# EasyEDA Pro project Power_Board_2026-08-07.eprj

# Schematic Schematic1

## Sheets
1 P1: Board Name: Board1; Create Date: 2026-08-07
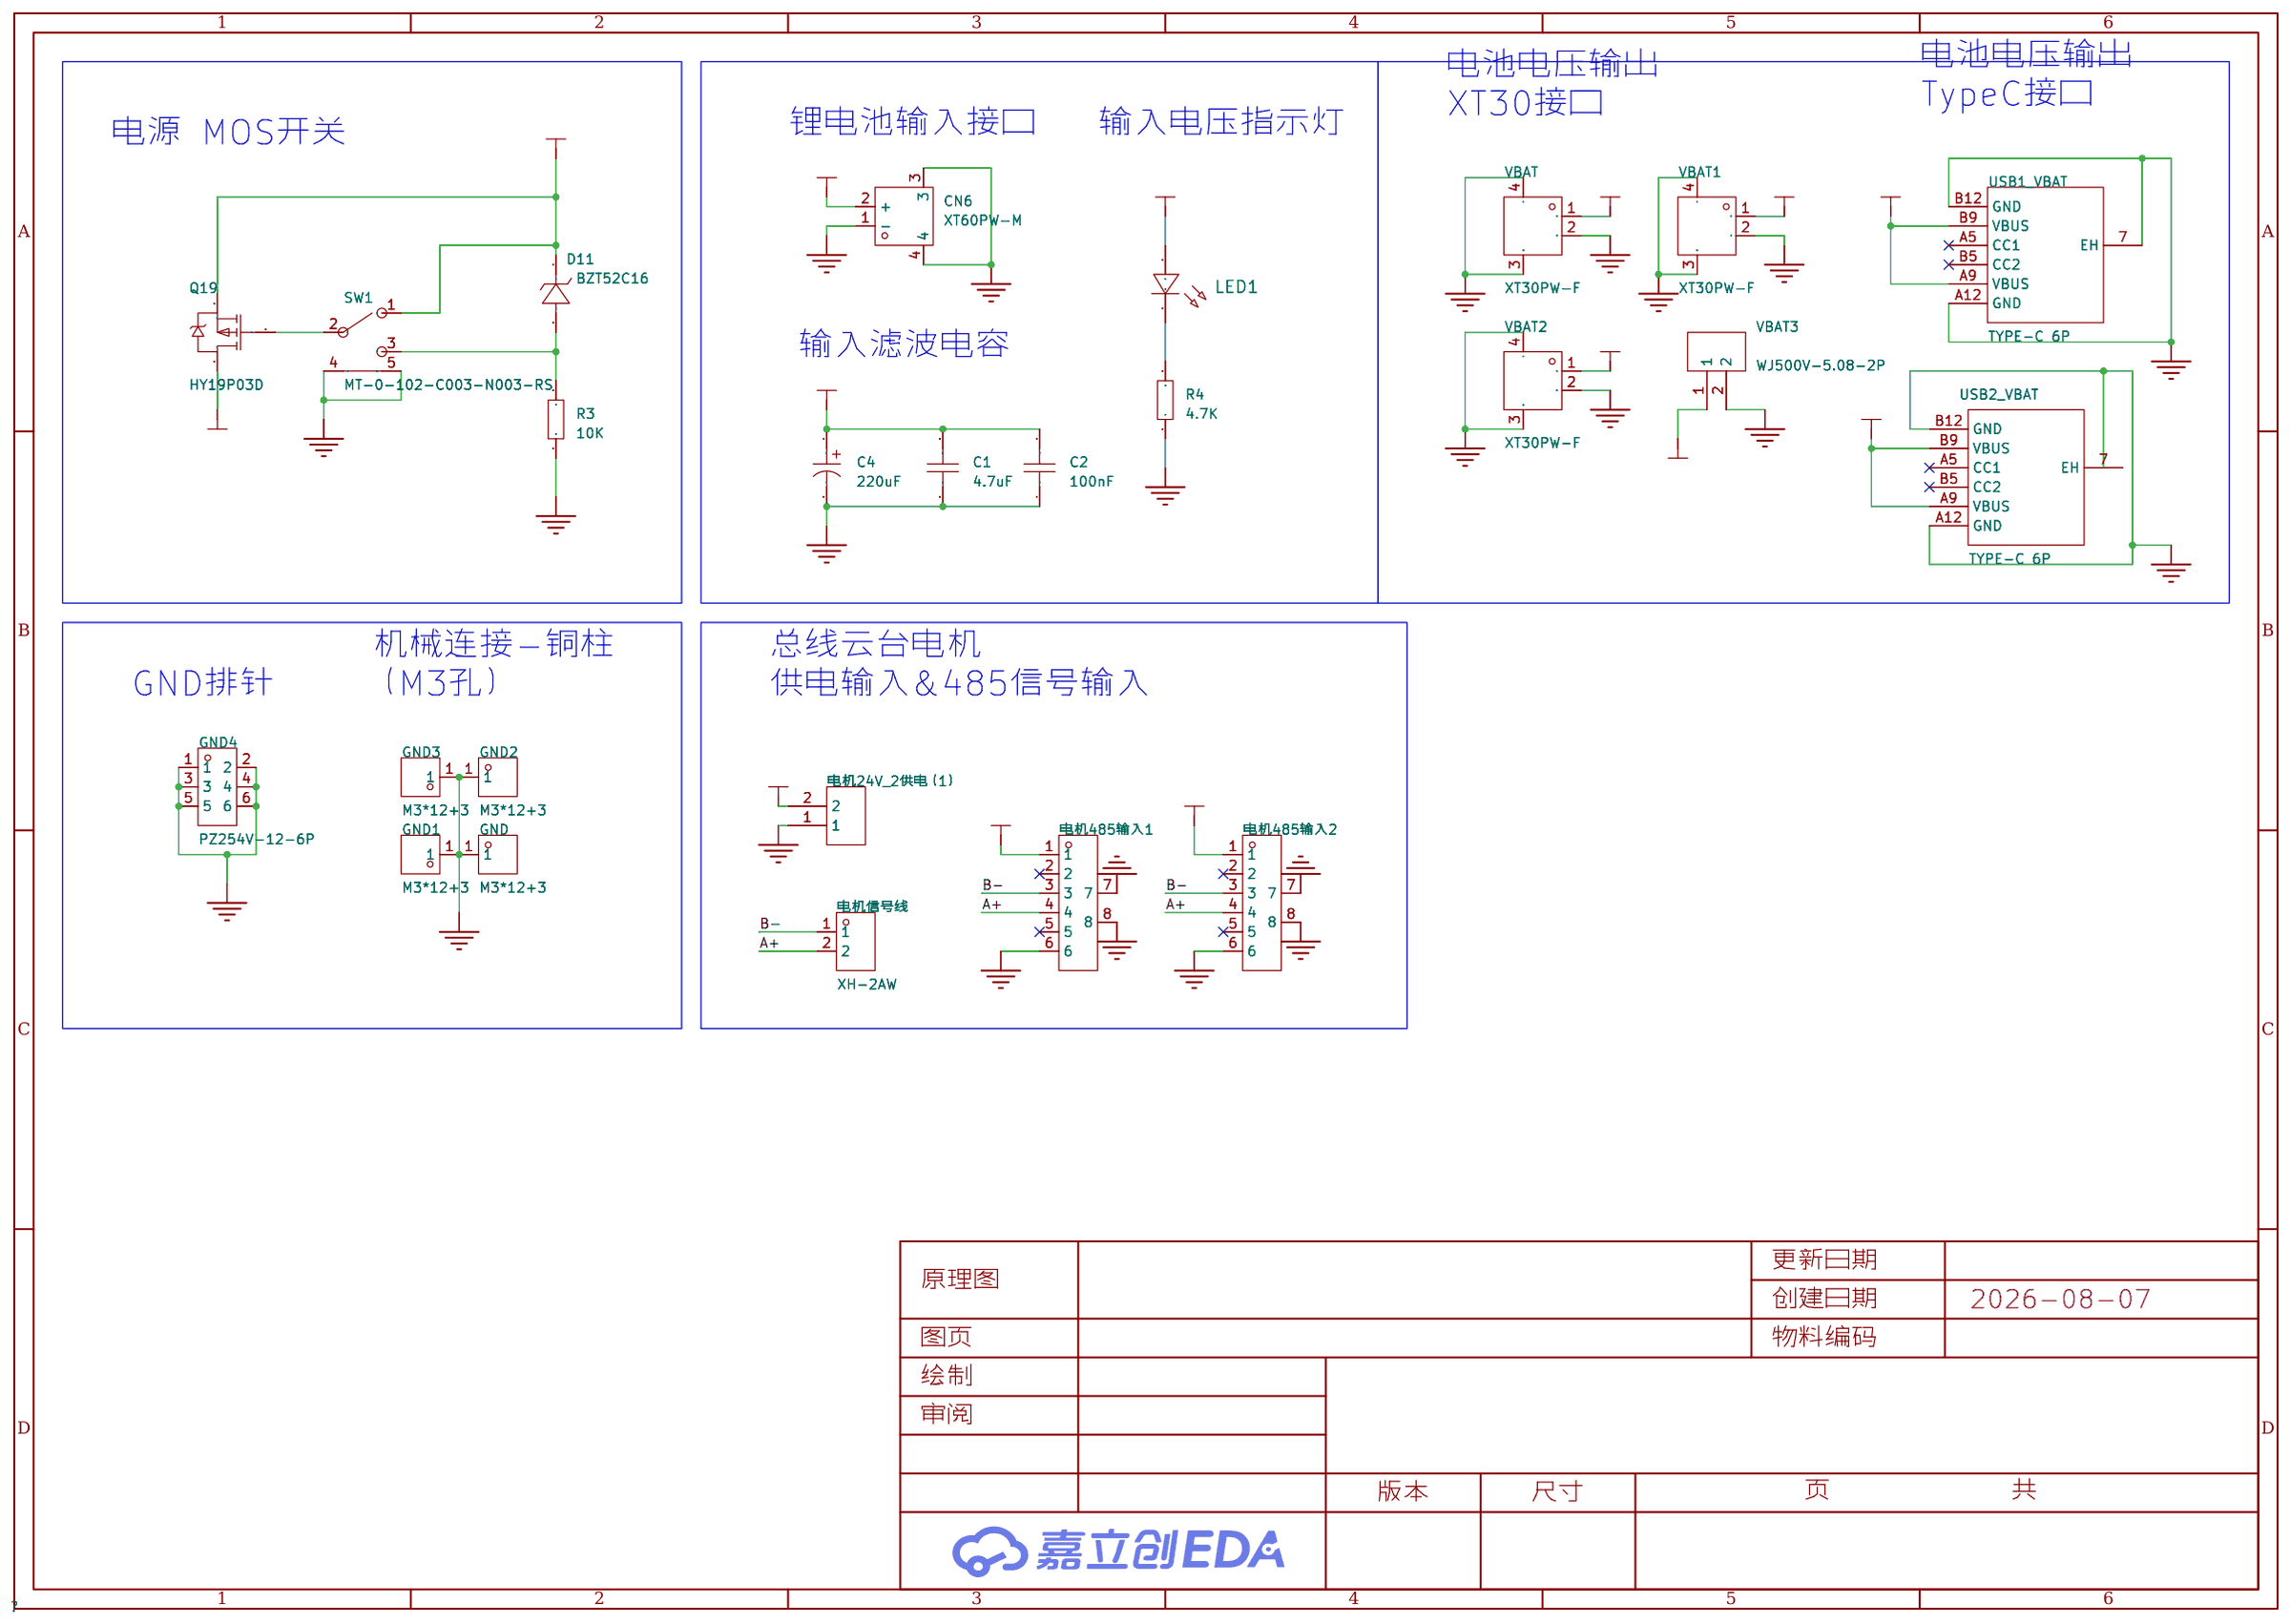
[diagram p0: P1]
2 P2: Create Date: 2026-08-10
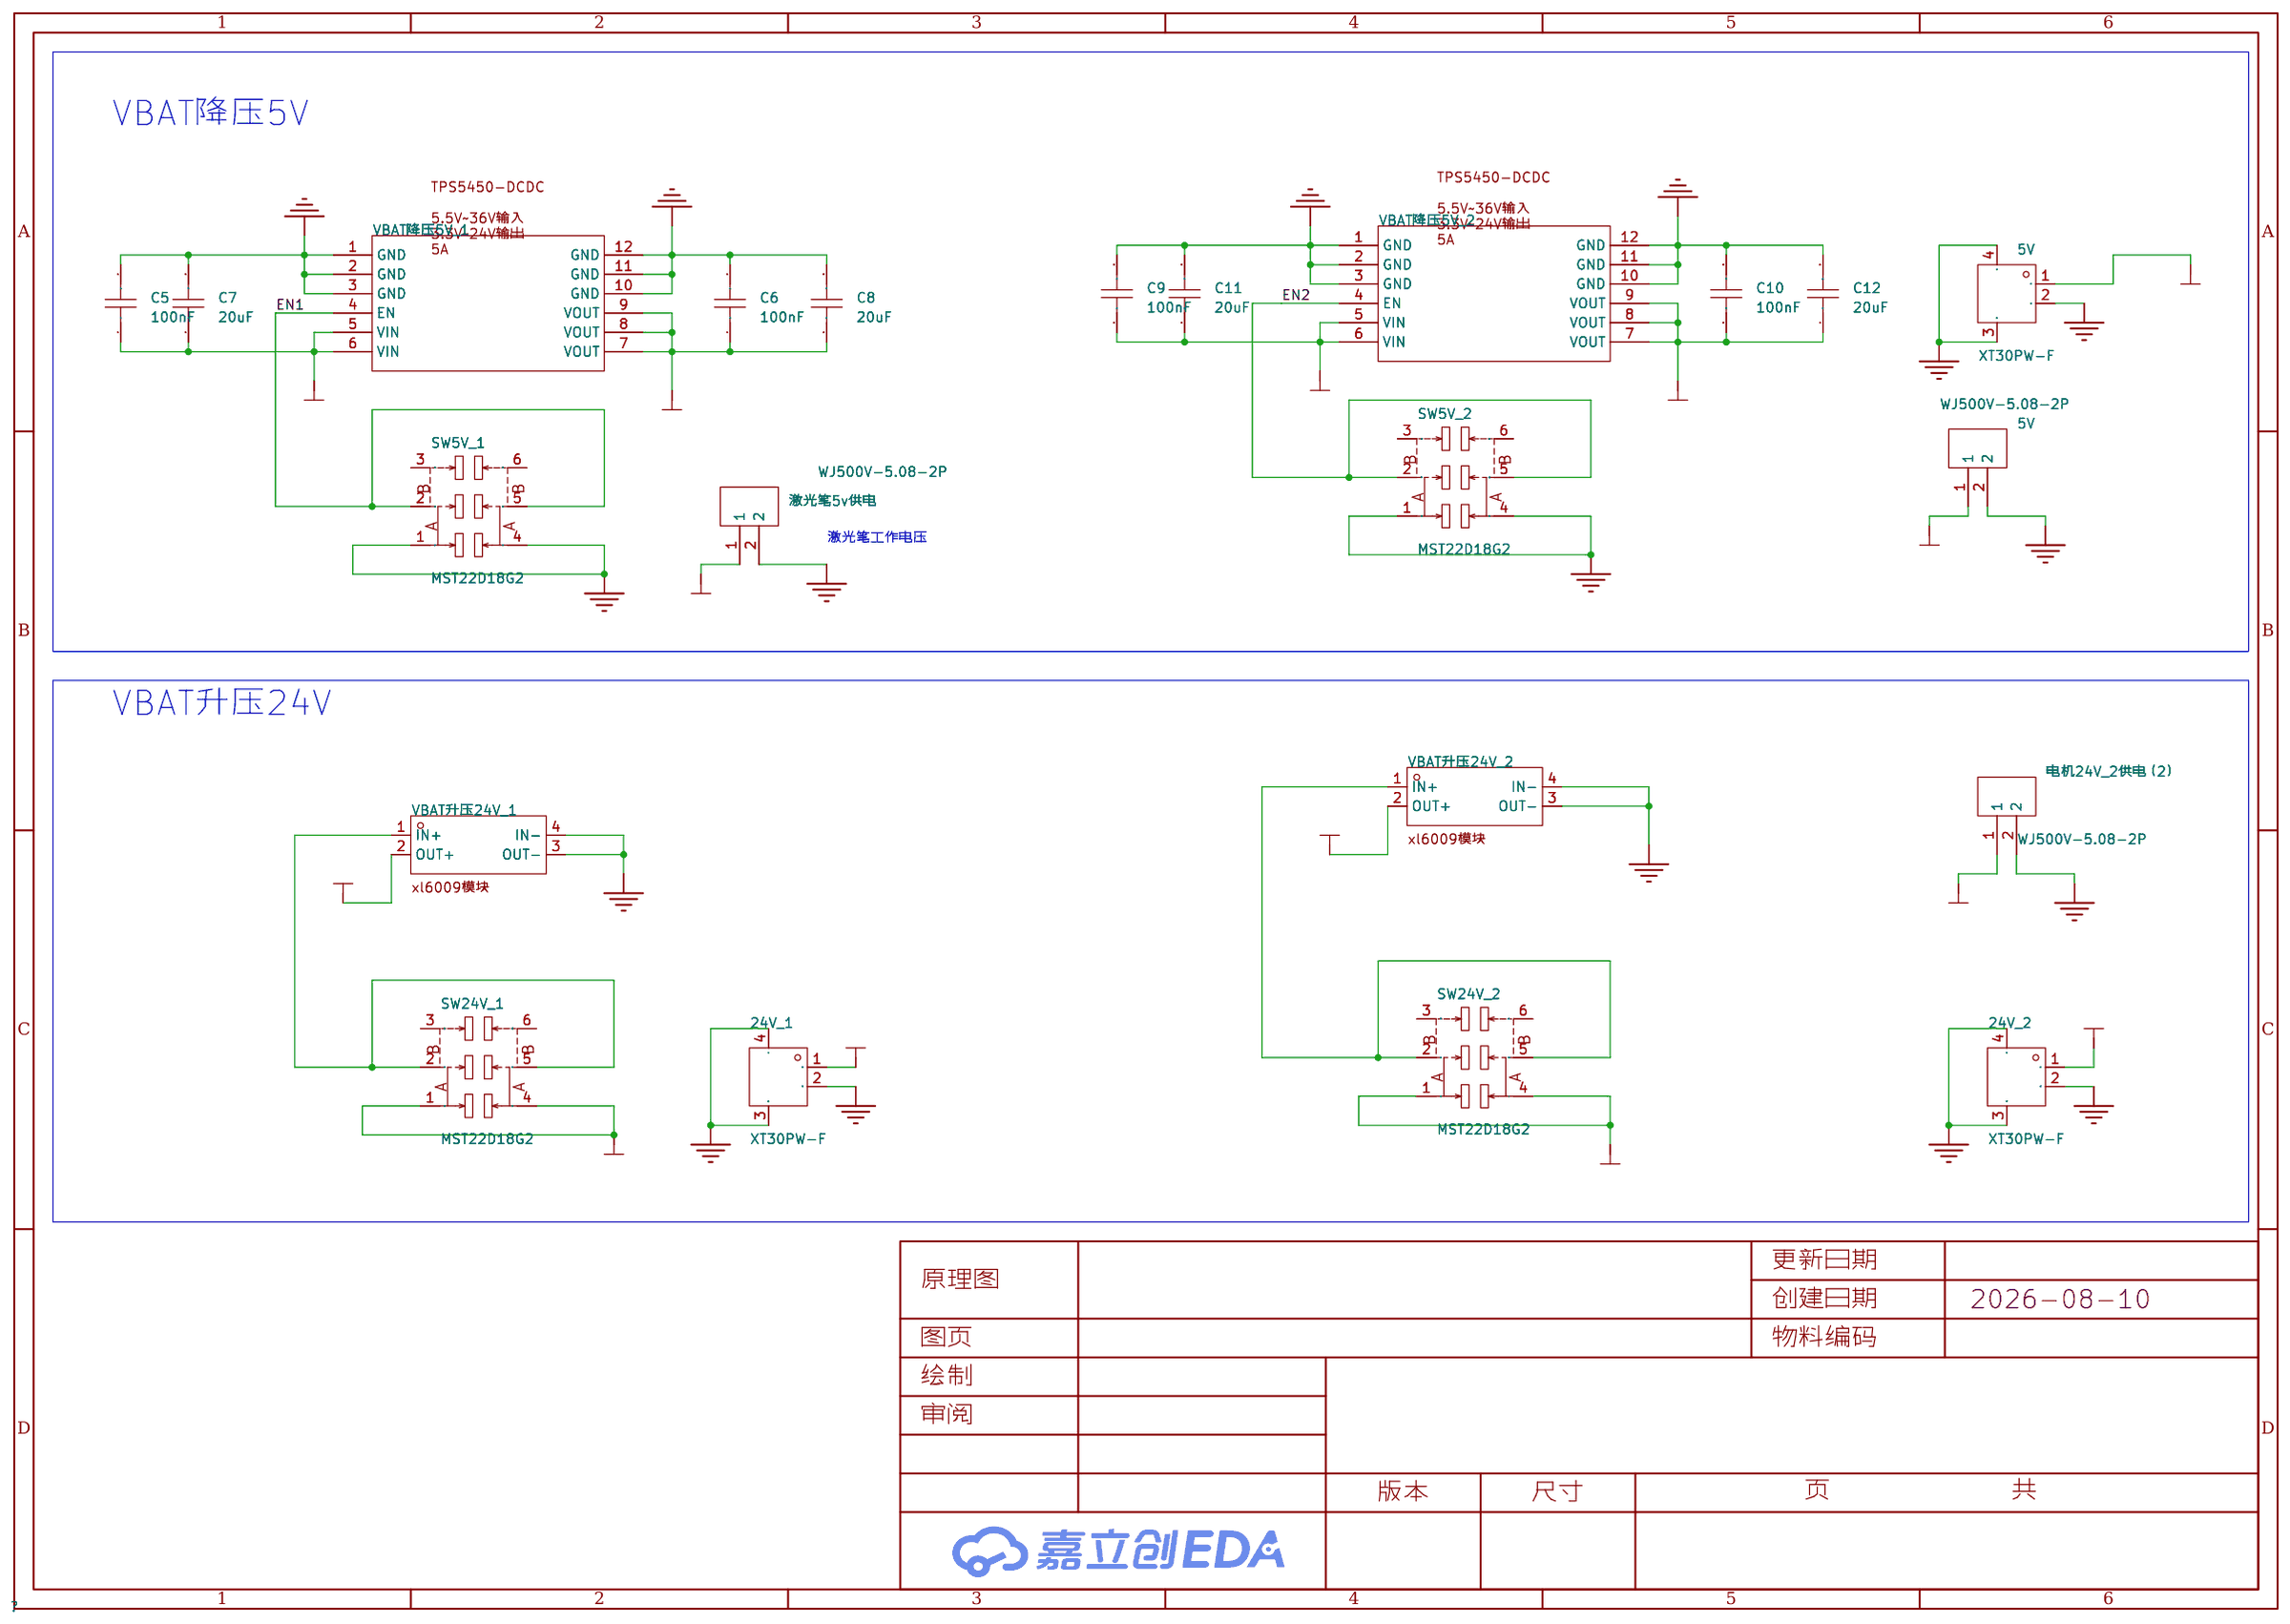
[diagram p1: P2]

## Parts
sheet P1
C1  4.7uF  [C1210]
C2  100nF  [C0603]
C4  220uF  [CAP-TH_BD8.0-P3.50-D0.6-FD-2]
CN6  XT60PW-M  [CONN-TH_XT60PW-M]
D11  BZT52C16  [SOD-123_L2.7-W1.7-LS3.8-RD]
GND  M3*12+3  [TH_BD4.7-D3.0]
GND1  M3*12+3  [TH_BD4.7-D3.0]
GND2  M3*12+3  [TH_BD4.7-D3.0]
GND3  M3*12+3  [TH_BD4.7-D3.0]
GND4  PZ254V-12-6P  [HDR-TH_6P-P2.54-V-M-R2-C3-S2.54]
LED1  -  [LED_0805]
Q19  HY19P03D  [TO-252-2_L6.6-W6.1-P4.57-LS9.9-TL-CW]
R3  10K  [R0603]
R4  4.7K  [R0603]
SW1  MT-0-102-C003-N003-RS  [SW-TH_MT-0-102-C003-N003-RS]
USB1_VBAT  TYPE-C 6P  [TYPE-C-SMD_TYPE-C-6P_1]
USB2_VBAT  TYPE-C 6P  [TYPE-C-SMD_TYPE-C-6P_1]
VBAT  XT30PW-F  [CONN-TH_XT30PW-F-1]
VBAT1  XT30PW-F  [CONN-TH_XT30PW-F-1]
VBAT2  XT30PW-F  [CONN-TH_XT30PW-F-1]
VBAT3  WJ500V-5.08-2P  [CONN-TH_2P-P5.00_WJ500V-5.08-2P]
电机24V_2供电（1）  WJ500V-5.08-2P  [CONN-TH_2P-P5.00_WJ500V-5.08-2P]
电机485输入1  HDGC1501WR-S-6P  [CONN-SMD_6P-P1.50_HDGC1501WR-S-6P]
电机485输入2  HDGC1501WR-S-6P  [CONN-SMD_6P-P1.50_HDGC1501WR-S-6P]
电机信号线  XH-2AW  [CONN-TH_XH-2AW_C2908611]
sheet P2
5V  XT30PW-F  [CONN-TH_XT30PW-F-1]
5V#2  WJ500V-5.08-2P  [CONN-TH_2P-P5.00_WJ500V-5.08-2P]
24V_1  XT30PW-F  [CONN-TH_XT30PW-F-1]
24V_2  XT30PW-F  [CONN-TH_XT30PW-F-1]
C5  100nF  [C0603]
C6  100nF  [C0603]
C7  20uF  [C2220]
C8  20uF  [C2220]
C9  100nF  [C0603]
C10  100nF  [C0603]
C11  20uF  [C2220]
C12  20uF  [C2220]
SW5V_1  MST22D18G2  [SW-SMD_MST22D18G2]
SW5V_2  MST22D18G2  [SW-SMD_MST22D18G2]
SW24V_1  MST22D18G2  [SW-SMD_MST22D18G2]
SW24V_2  MST22D18G2  [SW-SMD_MST22D18G2]
VBAT升压24V_1  -  [XL6009]
VBAT升压24V_2  -  [XL6009]
VBAT降压5V_1  -  [TPS5450降压模块]
VBAT降压5V_2  -  [TPS5450降压模块]
激光笔5v供电  WJ500V-5.08-2P  [CONN-TH_2P-P5.00_WJ500V-5.08-2P]
电机24V_2供电（2）  WJ500V-5.08-2P  [CONN-TH_2P-P5.00_WJ500V-5.08-2P]

## Library data of the parts
C1 = GRM32ER71H475KA88L: 容值:4.7uF;精度:±10%;额定电压:50V;材质(温度系数):X7R;; LCSC Part Name: 4.7uF ±10% 50V; Supplier Part: C86052; Manufacturer: muRata(村田); Supplier Footprint: 1210; JLCPCB Part Class: 扩展库; Datasheet: https://atta.szlcsc.com/upload/public/pdf/source/20200305/C490387_23319AE8C154DEB24C505E6C82A8106A.pdf; Supplier: LCSC; Tolerance: ±10%; Voltage Rated: 50V; Temperature Coefficient: X7R
C2 = CC0603KRX7R9BB104: 容值:100nF;精度:±10%;额定电压:50V;材质(温度系数):X7R;; LCSC Part Name: 100nF ±10% 50V; Supplier Part: C14663; Manufacturer: YAGEO(国巨); Supplier Footprint: 0603; JLCPCB Part Class: 基础库; Datasheet: https://atta.szlcsc.com/upload/public/pdf/source/20180910/C282072_33301C7F631E79921B82A8DAC6BCC5B3.pdf; Supplier: LCSC; Tolerance: ±10%; Voltage Rated: 50V; Temperature Coefficient: X7R
C4 = KNH2220UF35V149EC0049: 容值:220uF;精度:±20%;额定电压:35V;纹波电流:1.7A@100kHz;等效串联电阻:40mΩ@100kHz;; LCSC Part Name: 220uF ±20% 35V; Supplier Part: C2981462; Manufacturer: KNSCHA(科尼盛); Supplier Footprint: 插件,D8xL9mm; JLCPCB Part Class: 扩展库; Datasheet: https://atta.szlcsc.com/upload/public/pdf/source/20220426/9FC8A158D93B909CC105160B4A0CB698.pdf; Supplier: LCSC; Tolerance: ±20%; Rated Voltage: 35V; Ripple Current: 1.7A@100kHz; Equivalent Series Resistance(ESR): 40mΩ@100kHz; Lead Spacing: 3.5mm; φD: 8mm; L: 9mm; Lifetime @ Temp: 2000hrs@105℃; Operating Temperature: -55℃~+105℃
CN6 = XT60PW-M: 类别:-;类型1:-;; LCSC Part Name: AMASS(艾迈斯)航模插头xt60连接器150公母对接pw锂电池公头 板插卧式XT60PW-M; Supplier Part: C98732; Manufacturer: AMASS(艾迈斯); JLCPCB Part Class: 扩展库; Datasheet: https://atta.szlcsc.com/upload/public/pdf/source/20240118/44A3DCFF53BE25DC65378AFFB21277A4.pdf; Supplier: LCSC; Brand: 艾迈斯; Type: 卧式插头; Colour: 黄色; InterfaceType: 公头
D11 = BZT52C16_C727007: 二极管配置:独立式;稳压值(标称值):16V;稳压值(范围):15.3V~17.1V;功率:500mW;精度:-;; Supplier Part: C727007; Manufacturer: TWGMC(台湾迪嘉); Supplier Footprint: SOD-123; JLCPCB Part Class: 扩展库; Datasheet: https://atta.szlcsc.com/upload/public/pdf/source/20200828/C727006_A23CB424A23C0F54CFF10A724B844049.pdf; Supplier: LCSC; Diode Configuration: 独立式; Zener Voltage (Nom): 16V; Reverse Leakage Current (Ir): 100nA@11.2V; Zener Voltage (Range): 15.3V~17.1V; Power Dissipation: 500mW; Zener Impedance (Zzt): 40Ω
GND GND1-GND3 = M3*12+3: 铜柱M3*12+3; LCSC Part Name: 国产 铜柱M3*12+3 不环保 M3*12+3; Supplier Part: C110574; Manufacturer: 国产; JLCPCB Part Class: Extended Part; Supplier: LCSC
GND4 = PZ254V-12-6P: 插针结构:2x3P;间距:2.54mm;行距:2.54mm;圆针/方针:方针;安装类型:直插;排数:双排;总PIN位数:6P;额定电流:-;额定电压:-;配合针长度:6mm;塑高:2.5mm;端接针长度:3mm;触头材质:黄铜;触头镀层:-;工作温度范围:-40℃~+105℃;颜色:黑色;; LCSC Part Name: 间距:2.54mm 2x3P 直插 方针; Supplier Part: C492420; Manufacturer: XFCN(兴飞); Supplier Footprint: 插件,P=2.54mm; JLCPCB Part Class: 扩展库; Datasheet: https://atta.szlcsc.com/upload/public/pdf/source/20200309/C492420_BAECB307B001054C09D200388220EAE6.pdf; Supplier: LCSC; Pin Structure: 2x3P; Pitch: 2.54mm; Row Spacing: 2.54mm; Circluar Pins/Square Pins: 方针; Mounting Type: 直插; Number of Rows: 双排; Number of Pins: 6P; Length of Mating Pin: 6mm; Insulation Height: 2.5mm; Length of End Connection Pin: 3mm; Contact Material: 黄铜; Operating Temperature Range: -40℃~+105℃; Color: 黑色
LED1 = LED_0805-R: Supplier Footprint: 0805
Q19 = HY19P03D: 类型:P沟道;漏源电压(Vdss):30V;连续漏极电流(Id):90A;功率(Pd):50W;导通电阻(RDS(on)@Vgs,Id):6mΩ@10V,45A;阈值电压(Vgs(th)@Id):3V@250uA;; LCSC Part Name: P沟道 30V 90A; Supplier Part: C122492; Manufacturer: HUAYI(华羿微); Supplier Footprint: TO-252-2; JLCPCB Part Class: 扩展库; Datasheet: https://atta.szlcsc.com/upload/public/pdf/source/20170728/C122492_1501225751911848809.pdf; Supplier: LCSC; Type: P沟道; Drain Source Voltage (Vdss): 30V; Continuous Drain Current (Id): 90A; Power Dissipation (Pd): 50W; Drain Source On Resistance (RDS(on)@Vgs,Id): 6mΩ@10V,45A; Gate Threshold Voltage (Vgs(th)@Id): 3V@250uA
R3 R4 = Res_0603: Supplier Footprint: 0603
SW1 = MT-0-102-C003-N003-RS: 电路结构:单刀双掷;机械寿命:-;额定电流:5A;额定电压(AC):125V;安装方式:弯插;; LCSC Part Name: 小型钮子三脚二档(正弯脚); Supplier Part: C1788495; Manufacturer: YUEN FUNG(源丰); Supplier Footprint: 插件; JLCPCB Part Class: 扩展库; Datasheet: https://atta.szlcsc.com/upload/public/pdf/source/20201225/C1788495_6ED2FCF2206E4816011DDFBA986C5590.pdf; Supplier: LCSC; Circuit: 单刀双掷; Switch Length: 13.1mm; Switch Width: 8mm; Contact Current: 5A; Voltage Rating (AC): 125V; Actuator Type: 圆柱钮柄; Pin Style: PC引脚; Mounting Style: 弯插; Operating Temperature: -25℃~+85℃
USB1_VBAT USB2_VBAT = TYPE-C 6P: LCSC Part Name: 6P卧贴母座; Supplier Part: C456012; Manufacturer: SHOU HAN(首韩); Supplier Footprint: SMD; JLCPCB Part Class: 扩展库; Datasheet: https://item.szlcsc.com/datasheet/TYPE-C%25206P/458819.html; Supplier: LCSC; Connector Type: Type-C; Gender: 母; Mounting Type: 卧贴; Number of Contacts: 6P; Number of Ports: 1; Current Rating-Power: 3A; Voltage Rating: 5V; Connect-Disconnect Life: 3千次; Detection color: 黑色; Operating Temperature: -40℃~+85℃
5V 24V_1 24V_2 VBAT VBAT1 VBAT2 = XT30PW-F: 类别:-;类型1:-;; LCSC Part Name: AMASS(艾迈斯)电源连接器 母头 XT30PW-F; Supplier Part: C2913282; Manufacturer: AMASS(艾迈斯); JLCPCB Part Class: 扩展库; Datasheet: https://atta.szlcsc.com/upload/public/pdf/source/20231218/06CFCF98887A9A87638B0856A725C8FD.pdf; Supplier: LCSC; Brand: 艾迈斯; Type: 航模插头; InterfaceType: 母头
5V#2 VBAT3 激光笔5v供电 电机24V_2供电（2） = WJ500V-5.08-2P: LCSC Part Name: 1x2P 5.08mm 直插 排数:1 每排P数:2; Supplier Part: C8465; Manufacturer: KANGNEX(康奈克斯电气); Supplier Footprint: 插件,P=5.08mm; JLCPCB Part Class: 扩展库; Datasheet: https://item.szlcsc.com/datasheet/WJ500V-5.08-2P/8959.html; Supplier: LCSC; Number of Positions or Pins: 1x2P; Pitch: 5.08mm; Color: 绿色; Mounting Type: 直插; Number of Pins: 2P; Number of Rows: 1; Number of PINs Per Row: 2; Screw Specification: M2.5; Current Rating: 18A; Voltage Rating (Max): 250V; Wire Gauge - AWG: 14~30; Wire Gauge - mm2: 2.5; Operating Temperature: -40℃~+105℃
电机24V_2供电（1） = WJ500V-5.08-2P: LCSC Part Name: 1x2P 5.08mm 直插 排数:1 每排P数:2; Supplier Part: C8465; Manufacturer: KANGNEX(康奈克斯电气); Supplier Footprint: 插件,P=5.08mm; JLCPCB Part Class: 扩展库; Datasheet: https://item.szlcsc.com/datasheet/WJ500V-5.08-2P/8959.html; Supplier: LCSC; Number of Positions or Pins: 1x2P; Pitch: 5.08mm; Color: 绿色; Mounting Type: 直插; Number of Pins: 2P; Number of Rows: 1; Number of PINs Per Row: 2; Screw Specification: M2.5; Current Rating: 18A; Voltage Rating (Max): 250V; Wire Gauge - AWG: 14~30; Wire Gauge - mm2: 2.5; Operating Temperature: -40℃~+105℃; Structure: 1x2P; Mounting Style: 直插; Current Rating (Max): 18A; Operating Temperature Range: -40℃~+105℃
电机485输入1 电机485输入2 = HDGC1501WR-S-6P: 插针结构:1x6P;间距:1.5mm;安装方式:卧贴;参考系列:ZH;总PIN数:6P;排数:1;每排PIN数:6;行距:-;额定电流:1A;工作温度范围:-25℃~+70℃;; LCSC Part Name: 1x6P 间距:1.5mm 卧贴 系列:ZH; Supplier Part: C2936220; Manufacturer: HDGC(华德共创); Supplier Footprint: SMD,P=1.5mm,卧贴; JLCPCB Part Class: Extended Part; Datasheet: https://atta.szlcsc.com/upload/public/pdf/source/20211224/A5C6461CBF12DC2884B3F43D30F9D45A.pdf; Supplier: LCSC; Pins Structure: 1x6P; Pitch: 1.5mm; Mounting Style: 卧贴; Reference Series: ZH; Number of Pins: 6P; Number of Rows: 1; Number of PINs Per Row: 6; Current Rating (Max): 1A; Operating Temperature Range: -25℃~+70℃
电机信号线 = XH-2AW_C2908611: 插针结构:1x2P;间距:2.5mm;安装方式:弯插;参考系列:XH;总PIN数:2P;排数:1;每排PIN数:2;行距:-;额定电流:3A;触头材质:黄铜;触头镀层:锡;工作温度范围:-25℃~+85℃;; LCSC Part Name: 1x2P 间距:2.5mm 弯插 系列:XH; Supplier Part: C2908611; Manufacturer: HCTL(华灿天禄); Supplier Footprint: 弯插,P=2.5mm; JLCPCB Part Class: 扩展库; Datasheet: https://atta.szlcsc.com/upload/public/pdf/source/20230711/B565BAF3B11666EF6B81B3605408F2BD.pdf; Supplier: LCSC; Pins Structure: 1x2P; Pitch: 2.5mm; Mounting Style: 弯插; Reference Series: XH; Number of Pins: 2P; Number of Rows: 1; Number of PINs Per Row: 2; Current Rating (Max): 3A; Contact Material: 黄铜; Contact Plating: 锡; Operating Temperature Range: -25℃~+85℃
C5 C6 C9 C10 = FCC0603B104K500CT: LCSC Part Name: 100nF ±10% 50V; Supplier Part: C5137636; Manufacturer: FOJAN(富捷); Supplier Footprint: 0603; Datasheet: https://item.szlcsc.com/datasheet/FCC0603B104K500CT/5747088.html; Supplier: LCSC; Tolerance: ±10%; Voltage Rating: 50V; Temperature Coefficient: X7R
C7 C8 C11 C12 = C2220X206K5RLCAUTO: LCSC Part Name: 20uF ±10% 50V; Supplier Part: C3842434; Manufacturer: KEMET(基美); Supplier Footprint: 2220; Datasheet: https://atta.szlcsc.com/upload/public/pdf/source/231023/C1812C944KARLC7800-0e709abee088822a599ce4fc1cb526dd.pdf; Supplier: LCSC; Tolerance: ±10%; Voltage Rated: 50V; Temperature Coefficient: X7R
SW5V_1 SW5V_2 SW24V_1 SW24V_2 = MST22D18G2: LCSC Part Name: MST-22D18G2; Supplier Part: C431544; Manufacturer: SHOU HAN(首韩); Supplier Footprint: SMD,9.1x3.6mm; JLCPCB Part Class: 扩展库; Datasheet: https://item.szlcsc.com/datasheet/MST22D18G2/427901.html; Supplier: LCSC; Circuit: 双刀双掷; Termination Style: SMD接片; Length: 9.1mm; Width: 3.6mm; Switch Height: 3.45mm; Mounting Type: 立贴; Current Rating: 50mA; Voltage Rating: 12V; Life: 1万次; Operating Temperature: -30℃~+80℃
VBAT升压24V_1 VBAT升压24V_2 = XL6009
VBAT降压5V_1 VBAT降压5V_2 = TPS5450降压模块

## Nets
+5V_2: 5V.1 5V#2.1 C10.1 C12.1 VBAT降压5V_2.7(VOUT) VBAT降压5V_2.8(VOUT) VBAT降压5V_2.9(VOUT)
+24V_1: 24V_1.1 VBAT升压24V_1.2(OUT+)
+24V_2: 24V_2.1 VBAT升压24V_2.2(OUT+) 电机24V_2供电（1）.2 电机24V_2供电（2）.1 电机485输入1.1 电机485输入2.1
GND: 5V.2 5V.3 5V.4 5V#2.2 24V_1.2 24V_1.3 24V_1.4 24V_2.2 24V_2.3 24V_2.4 C1.1 C2.1 C4.2 C5.2 C6.2 C7.2 C8.2 C9.2 C10.2 C11.2 C12.2 CN6.1(-) CN6.3 CN6.4 GND.1 GND1.1 GND2.1 GND3.1 GND4.1 GND4.2 GND4.3 GND4.4 GND4.5 GND4.6 R3.1 R4.1 SW1.4 SW1.5 SW5V_1.1 SW5V_1.4 SW5V_2.1 SW5V_2.4 USB1_VBAT.7(EH) USB1_VBAT.A12(GND) USB1_VBAT.B12(GND) USB2_VBAT.7(EH) USB2_VBAT.A12(GND) USB2_VBAT.B12(GND) VBAT.2 VBAT.3 VBAT.4 VBAT1.2 VBAT1.3 VBAT1.4 VBAT2.2 VBAT2.3 VBAT2.4 VBAT3.2 VBAT升压24V_1.3(OUT-) VBAT升压24V_1.4(IN-) VBAT升压24V_2.3(OUT-) VBAT升压24V_2.4(IN-) VBAT降压5V_1.1(GND) VBAT降压5V_1.2(GND) VBAT降压5V_1.3(GND) VBAT降压5V_1.10(GND) VBAT降压5V_1.11(GND) VBAT降压5V_1.12(GND) VBAT降压5V_2.1(GND) VBAT降压5V_2.2(GND) VBAT降压5V_2.3(GND) VBAT降压5V_2.10(GND) VBAT降压5V_2.11(GND) VBAT降压5V_2.12(GND) 激光笔5v供电.2 电机24V_2供电（1）.1 电机24V_2供电（2）.2 电机485输入1.6 电机485输入1.7 电机485输入1.8 电机485输入2.6 电机485输入2.7 电机485输入2.8
VBAT: C1.2 C2.2 C4.1 C5.1 C7.1 C9.1 C11.1 LED1.2(A) Q19.2(D) SW24V_1.1 SW24V_1.4 SW24V_2.1 SW24V_2.4 USB1_VBAT.A9(VBUS) USB1_VBAT.B9(VBUS) USB2_VBAT.A9(VBUS) USB2_VBAT.B9(VBUS) VBAT.1 VBAT1.1 VBAT2.1 VBAT3.1 VBAT降压5V_1.5(VIN) VBAT降压5V_1.6(VIN) VBAT降压5V_2.5(VIN) VBAT降压5V_2.6(VIN)
VBUS: CN6.2(+) D11.1(K) Q19.3(S) SW1.1
A+: 电机485输入1.4 电机485输入2.4 电机信号线.2
B-: 电机485输入1.3 电机485输入2.3 电机信号线.1
EN1: SW5V_1.2 SW5V_1.5 VBAT降压5V_1.4(EN)
EN2: SW5V_2.2 SW5V_2.5 VBAT降压5V_2.4(EN)
VOP_5V: C6.1 C8.1 VBAT降压5V_1.7(VOUT) VBAT降压5V_1.8(VOUT) VBAT降压5V_1.9(VOUT) 激光笔5v供电.1
$1N642: Q19.1(G) SW1.2
$1N648: LED1.1(C) R4.2
$1N653: D11.2(A) R3.2 SW1.3
$2N1435: SW24V_2.2 SW24V_2.5 VBAT升压24V_2.1(IN+)
$2N5555: SW24V_1.2 SW24V_1.5 VBAT升压24V_1.1(IN+)

Not connected (* = marked no-connect by the designer): SW5V_1 3 6; SW5V_2 3 6; SW24V_1 3 6; SW24V_2 3 6; USB1_VBAT A5(CC1)* B5(CC2)*; USB2_VBAT A5(CC1)* B5(CC2)*; 电机485输入1 2* 5*; 电机485输入2 2* 5*

## Notes on the sheets
sheet 1
- 电池电压输出
  TypeC接口
- 电池电压输出
  XT30接口
- 电源 MOS开关
- 锂电池输入接口
- 输入电压指示灯
- 输入滤波电容
- GND排针
- 机械连接-铜柱
  （M3孔）
- 总线云台电机
  供电输入&485信号输入
sheet 2
- VBAT降压5V
- 激光笔工作电压
- VBAT升压24V

# Board PCB1
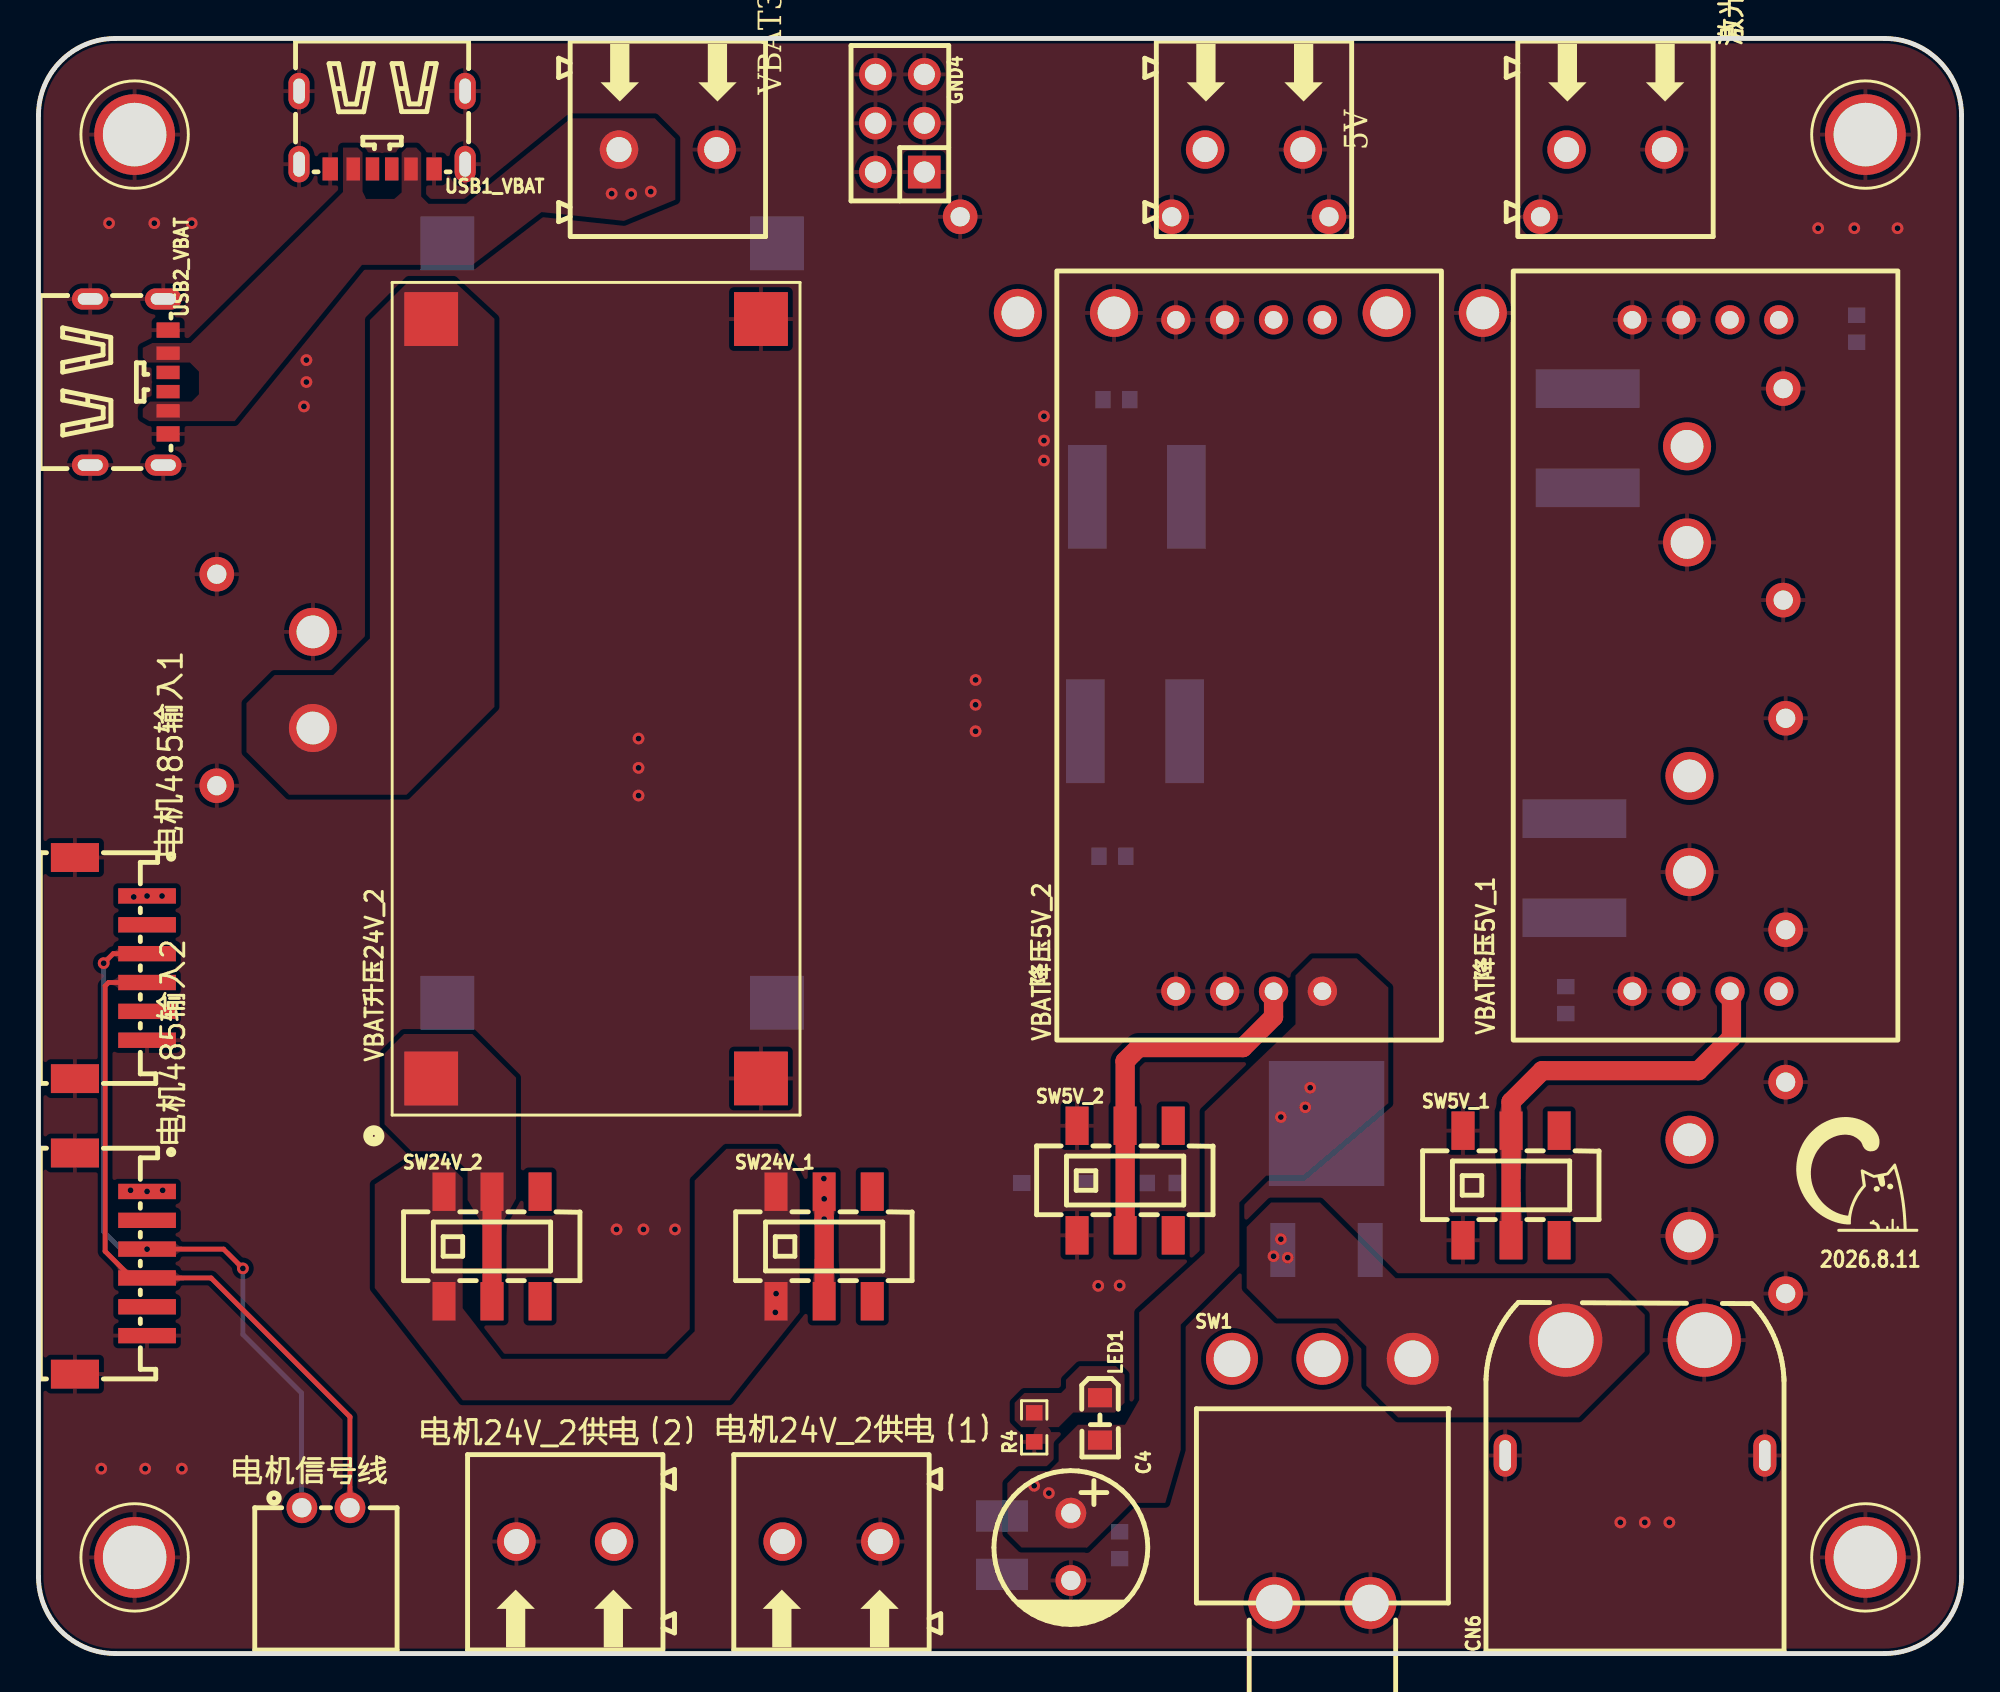
[diagram p2: board, top side]
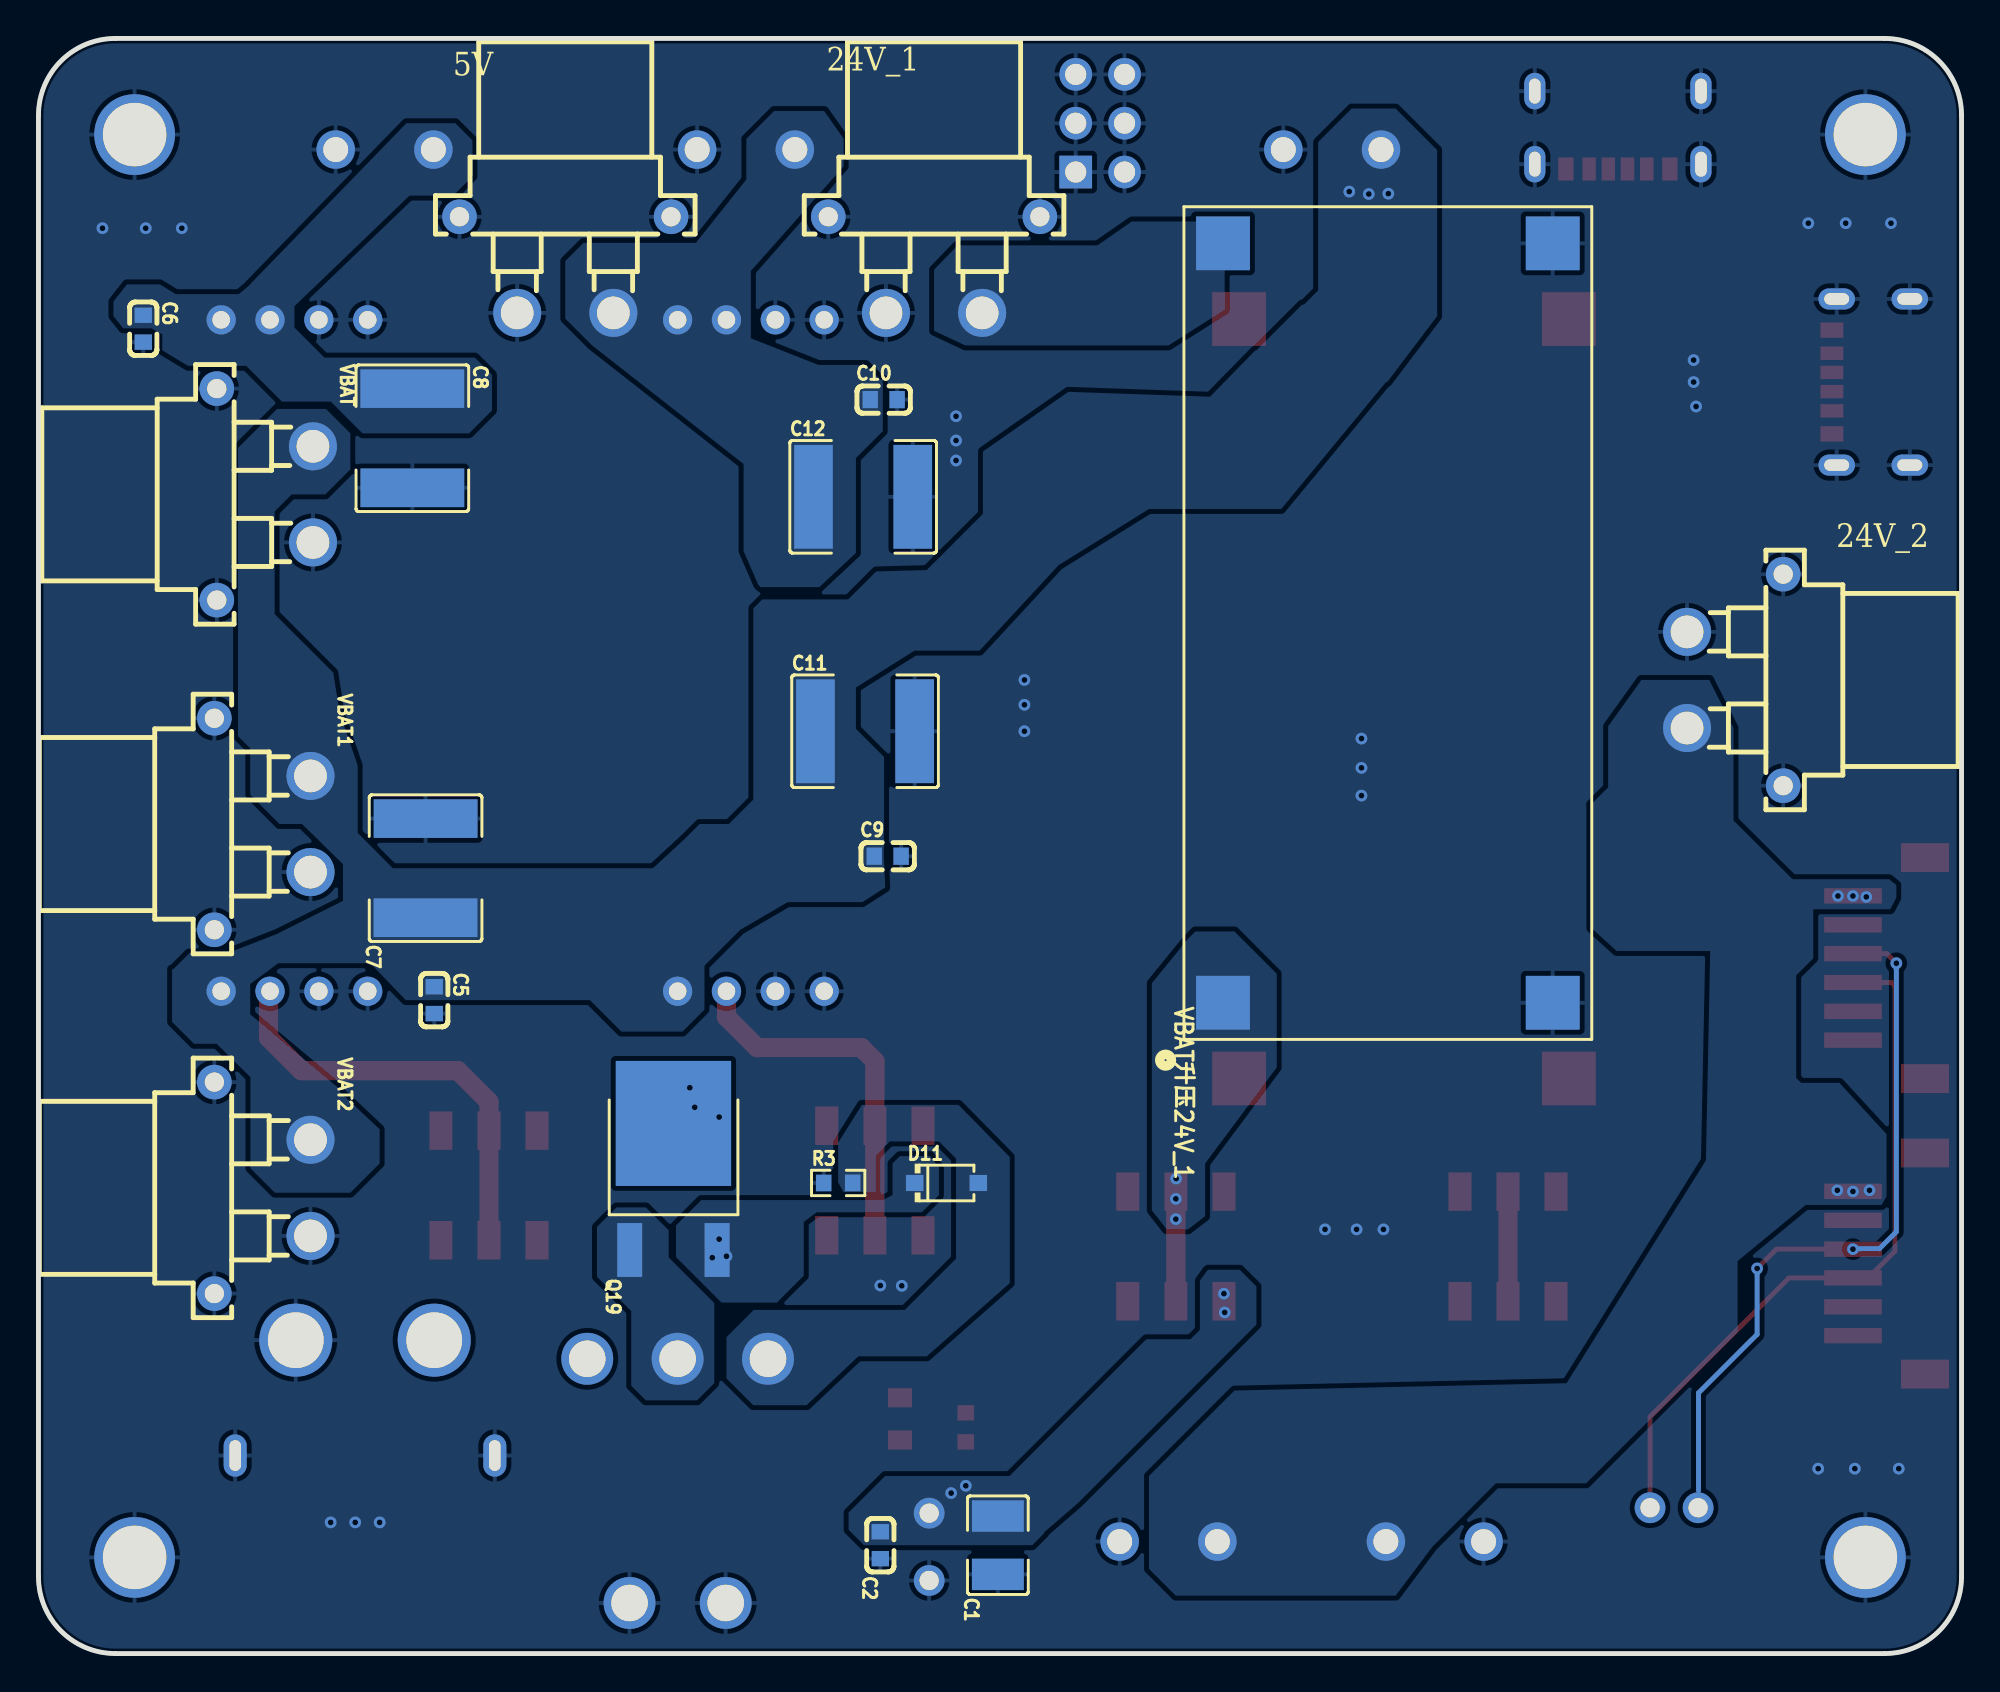
[diagram p3: board, bottom side, seen from below]

Outline 100 x 84 mm; copper layers: Top Layer, Bottom Layer. Coordinates in mm from the lower left corner of the outline.
Outline path: 0,80 0,4 arc(1.17,1.17) 4,0 96,0 arc(98.83,1.17) 100,4 100,80 arc(98.83,82.83) 96,84 4,84 arc(1.17,82.83) 0,80
Stack: Top Layer 0.035mm / Dielectric1 1.51mm FR4 er 4.5 / Bottom Layer 0.035mm

## Design rules (mm)
net B-: DP1
net A+: DP1
template: JLCPCB Capability(Two Layers Board)
spacing copperThickness1oz (default): track to track 0.102, other pairs 0.152 to 0.3
spacing copperThickness2oz: track to track 0.203, other pairs 0.152 to 0.3
track width copperThickness1oz (default): min 0.127, default 0.254, max 2.54
track width copperThickness2oz: min 0.203, default 0.254, max 2.54
differential pair differentialPair (default): width min 0.127, default 0.254, max 2.54; gap min 0.152, default 0.152
via viaSize (default): diameter min 0.5, default 0.61, max 10; hole min 0.3, default 0.305, max 6.3

## Placement (name value [footprint] x y rotation side)
5V  XT30PW-F  [CONN-TH_2P-P5.00_WJ500V-5.08-2P]  63.21 78.22 0 top
5V#2  WJ500V-5.08-2P  [CONN-TH_XT30PW-F-1]  72.61 72.23 0 bottom
24V_1  XT30PW-F  [CONN-TH_XT30PW-F-1]  53.43 72.23 0 bottom
24V_2  XT30PW-F  [CONN-TH_XT30PW-F-1]  11.77 50.64 90 bottom
C1  4.7uF  [C1210]  50.11 5.63 90 bottom
C2  100nF  [C0603]  56.22 5.63 90 bottom
C4  220uF  [CAP-TH_BD8.0-P3.50-D0.6-FD-2]  53.68 5.55 270 top
C5  100nF  [C0603]  79.42 33.98 270 bottom
C6  100nF  [C0603]  94.55 68.9 270 bottom
C7  20uF  [C2220]  79.87 40.85 90 bottom
C8  20uF  [C2220]  80.56 63.21 270 bottom
C9  100nF  [C0603]  55.84 41.47 180 bottom
C10  100nF  [C0603]  56.05 65.22 180 bottom
C11  20uF  [C2220]  57.02 47.97 180 bottom
C12  20uF  [C2220]  57.12 60.16 180 bottom
CN6  XT60PW-M  [CONN-TH_XT60PW-M]  83.02 13.3 90 top
D11  BZT52C16  [SOD-123_L2.7-W1.7-LS3.8-RD]  52.78 24.47 180 bottom
GND  M3*12+3  [TH_BD4.7-D3.0]  95 5 0 top
GND1  M3*12+3  [TH_BD4.7-D3.0]  5 5 0 top
GND2  M3*12+3  [TH_BD4.7-D3.0]  95 79 0 top
GND3  M3*12+3  [TH_BD4.7-D3.0]  5 79 0 top
GND4  PZ254V-12-6P  [HDR-TH_6P-P2.54-V-M-R2-C3-S2.54]  44.79 79.59 90 top
LED1  YLED0805R  [LED_0805]  55.2 12.16 270 top
Q19  HY19P03D  [TO-252-2_L6.6-W6.1-P4.57-LS9.9-TL-CW]  66.98 24.28 90 bottom
R3  10K  [R0603]  58.41 24.47 180 bottom
R4  4.7K  [R0603]  51.78 11.76 90 top
SW1  MT-0-102-C003-N003-RS  [SW-TH_MT-0-102-C003-N003-RS]  66.76 8.98 0 top
SW5V_1  MST22D18G2  [SW-SMD_MST22D18G2]  76.58 24.35 0 top
SW5V_2  MST22D18G2  [SW-SMD_MST22D18G2]  56.5 24.6 0 top
SW24V_1  MST22D18G2  [SW-SMD_MST22D18G2]  40.86 21.17 0 top
SW24V_2  MST22D18G2  [SW-SMD_MST22D18G2]  23.58 21.17 0 top
USB1_VBAT  TYPE-C 6P  [TYPE-C-SMD_TYPE-C-6P_1]  17.87 79.24 180 top
USB2_VBAT  TYPE-C 6P  [TYPE-C-SMD_TYPE-C-6P_1]  4.72 66.13 270 top
VBAT  XT30PW-F  [CONN-TH_XT30PW-F-1]  88.23 60.29 270 bottom
VBAT1  XT30PW-F  [CONN-TH_XT30PW-F-1]  88.35 43.14 270 bottom
VBAT2  XT30PW-F  [CONN-TH_XT30PW-F-1]  88.35 24.22 270 bottom
VBAT3  WJ500V-5.08-2P  [CONN-TH_2P-P5.00_WJ500V-5.08-2P]  32.73 78.22 0 top
VBAT升压24V_1  -  [XL6009]  32.73 51.65 90 bottom
VBAT升压24V_2  -  [XL6009]  26.1 47.72 90 top
VBAT降压5V_1  -  [TPS5450降压模块]  86.69 51.91 90 top
VBAT降压5V_2  -  [TPS5450降压模块]  62.95 51.91 90 top
激光笔5v供电  WJ500V-5.08-2P  [CONN-TH_2P-P5.00_WJ500V-5.08-2P]  82 78.22 0 top
电机24V_2供电（1）  WJ500V-5.08-2P  [CONN-TH_2P-P5.00_WJ500V-5.08-2P]  41.24 5.82 180 top
电机24V_2供电（2）  WJ500V-5.08-2P  [CONN-TH_2P-P5.00_WJ500V-5.08-2P]  27.39 5.82 180 top
电机485输入1  HDGC1501WR-S-6P  [CONN-SMD_6P-P1.50_HDGC1501WR-S-6P]  3.77 35.65 270 top
电机485输入2  HDGC1501WR-S-6P  [CONN-SMD_6P-P1.50_HDGC1501WR-S-6P]  3.77 20.28 270 top
电机信号线  XH-2AW  [CONN-TH_XH-2AW_C2908611]  14.95 7.58 0 top

## Footprints (pads in the part's own frame, mm; a bottom-side part is the same pattern mirrored in y, then rotated)
C0603
  rect 0.8x0.9 smd: 1(-0.7,0) 2(0.7,0)
C1210
  rect 1.635x2.7 smd: 1(-1.518,0) 2(1.518,0)
C2220
  rect 2.01x5.4 smd: 1(-2.58,0) 2(2.58,0)
CAP-TH_BD8.0-P3.50-D0.6-FD-2
  round 1.6 hole 1: 1(-1.75,0) 2(1.75,0)
CONN-SMD_6P-P1.50_HDGC1501WR-S-6P
  rect 0.8x3 smd: 1(-3.75,1.875) 2(-2.25,1.875) 3(-0.75,1.875) 4(0.75,1.875) 5(2.25,1.875) 6(3.75,1.875)
  rect 1.5x2.5 smd: 7(5.75,-1.875) 8(-5.75,-1.875)
CONN-TH_2P-P5.00_WJ500V-5.08-2P
  round 2 hole 1.3: 1(-2.54,0) 2(2.54,0)
CONN-TH_XH-2AW_C2908611
  round 1.6 hole 1: 1(-1.25,0) 2(1.25,0)
CONN-TH_XT30PW-F-1
  round 2.5 hole 1.7: 1(-2.5,2.5) 2(2.5,2.5)
  round 1.8 hole 1: 3(5.5,-2.5) 4(-5.5,-2.5)
CONN-TH_XT60PW-M
  round 3.8 hole 2.9: 1(3,-3.6) 2(3,3.6)
  oval 2.2x1.2 hole 1.6x0.6: 3(-3,6.75) 4(-3,-6.75)
HDR-TH_6P-P2.54-V-M-R2-C3-S2.54
  rect 1.7x1.7 hole 1.1: 1(-2.54,-1.27)
  round 1.7 hole 1.1: 2(-2.54,1.27) 3(0,-1.27) 4(0,1.27) 5(2.54,-1.27) 6(2.54,1.27)
LED_0805
  rect 1x1.25 smd: 1(-1.15,0.005) 2(1.05,0.005)
R0603
  rect 0.806x0.864 smd: 1(-0.753,0) 2(0.753,0)
SOD-123_L2.7-W1.7-LS3.8-RD
  rect 0.91x0.84 smd: 1(-1.655,0) 2(1.655,0)
SW-SMD_MST22D18G2
  rect 1.2x2 smd: 1(-2.5,2.85) 2(0,2.85) 3(2.5,2.85) 4(-2.5,-2.85) 5(0,-2.85) 6(2.5,-2.85)
SW-TH_MT-0-102-C003-N003-RS
  round 2.7 hole 1.9: 1(4.7,6.35) 2(0,6.35) 3(-4.7,6.35) 4(-2.5,-6.35) 5(2.5,-6.35)
TH_BD4.7-D3.0
  round 4.2 hole 3.3: 1(0,0)
TO-252-2_L6.6-W6.1-P4.57-LS9.9-TL-CW
  rect 2.8x1.3 smd: 1(-3.292,2.273) 3(-3.292,-2.273)
  rect 6.5x6 smd: 2(3.292,0)
TPS5450降压模块
  round 1.524 hole 0.914: 2(-17.46,3.81) 3(-17.46,1.27) 4(-17.46,-1.27) 5(-17.46,-3.81) 8(17.46,-3.81) 9(17.46,-1.27) 10(17.46,1.27) 11(17.46,3.81)
TYPE-C-SMD_TYPE-C-6P_1
  oval 1.1x1.9 hole 0.6x1.3: 7(-4.32,1.775) 7(-4.32,-2.025) 7(4.32,1.775) 7(4.32,-2.025)
  rect 0.7x1.2 smd: A5(-0.5,2.025) A9(1.5,2.025) B5(0.5,2.025) B9(-1.5,2.025)
  rect 0.8x1.2 smd: A12(2.7,2.025) B12(-2.7,2.025)
XL6009
  rect 2.8x2.8 smd: 1(-17.806,5.678) 2(21.692,5.678) 3(21.692,-11.469) 4(-17.806,-11.469)

## Nets
+5V_2: 5V.1 5V#2.1 C10.1 C12.1 VBAT降压5V_2.8 VBAT降压5V_2.9
+24V_1: 24V_1.1 VBAT升压24V_1.2
+24V_2: 24V_2.1 VBAT升压24V_2.2 电机24V_2供电（1）.2 电机24V_2供电（2）.1 电机485输入1.1 电机485输入2.1
GND: 5V.2 5V#2.2 5V#2.3 5V#2.4 24V_1.2 24V_1.3 24V_1.4 24V_2.2 24V_2.3 24V_2.4 C1.1 C2.1 C4.2 C5.2 C6.2 C7.2 C8.2 C9.2 C10.2 C11.2 C12.2 CN6.1 CN6.3 CN6.4 GND.1 GND1.1 GND2.1 GND3.1 GND4.1 GND4.2 GND4.3 GND4.4 GND4.5 GND4.6 R3.1 R4.1 SW1.4 SW1.5 SW5V_1.1 SW5V_1.4 SW5V_2.1 SW5V_2.4 USB1_VBAT.7 USB1_VBAT.A12 USB1_VBAT.B12 USB2_VBAT.7 USB2_VBAT.A12 USB2_VBAT.B12 VBAT.2 VBAT.3 VBAT.4 VBAT1.2 VBAT1.3 VBAT1.4 VBAT2.2 VBAT2.3 VBAT2.4 VBAT3.2 VBAT升压24V_1.3 VBAT升压24V_1.4 VBAT升压24V_2.3 VBAT升压24V_2.4 VBAT降压5V_1.2 VBAT降压5V_1.3 VBAT降压5V_1.10 VBAT降压5V_1.11 VBAT降压5V_2.2 VBAT降压5V_2.3 VBAT降压5V_2.10 VBAT降压5V_2.11 激光笔5v供电.2 电机24V_2供电（1）.1 电机24V_2供电（2）.2 电机485输入1.6 电机485输入1.7 电机485输入1.8 电机485输入2.6 电机485输入2.7 电机485输入2.8
VBAT: C1.2 C2.2 C4.1 C5.1 C7.1 C9.1 C11.1 LED1.2 Q19.2 SW24V_1.1 SW24V_1.4 SW24V_2.1 SW24V_2.4 USB1_VBAT.A9 USB1_VBAT.B9 USB2_VBAT.A9 USB2_VBAT.B9 VBAT.1 VBAT1.1 VBAT2.1 VBAT3.1 VBAT降压5V_1.5 VBAT降压5V_2.5
VBUS: CN6.2 D11.1 Q19.3 SW1.1
A+: 电机485输入1.4 电机485输入2.4 电机信号线.2
B-: 电机485输入1.3 电机485输入2.3 电机信号线.1
EN1: SW5V_1.2 SW5V_1.5 VBAT降压5V_1.4
EN2: SW5V_2.2 SW5V_2.5 VBAT降压5V_2.4
VOP_5V: C6.1 C8.1 VBAT降压5V_1.8 VBAT降压5V_1.9 激光笔5v供电.1
$1N642: Q19.1 SW1.2
$1N648: LED1.1 R4.2
$1N653: D11.2 R3.2 SW1.3
$2N1435: SW24V_2.2 SW24V_2.5 VBAT升压24V_2.1
$2N5555: SW24V_1.2 SW24V_1.5 VBAT升压24V_1.1

Pads without a net: SW5V_1 3 6; SW5V_2 3 6; SW24V_1 3 6; SW24V_2 3 6; USB1_VBAT A5 B5; USB2_VBAT A5 B5; 电机485输入1 2 5; 电机485输入2 2 5

## Via types
v1: diameter 0.61, hole 0.305, Top Layer to Bottom Layer, 54 vias

## Routing (per net, layer and track width the routed paths; a pad name or vN(x,y) marks a point on that pad's centre or on a via; arc(x,y) is an arc through that point)
+24V_2:
  vias: v1(4.79,24.09) v1(4.95,39.35) v1(5.65,39.4) v1(5.65,24.03) v1(6.43,39.4) v1(6.46,24.09)
GND:
  vias: v1(3.26,9.62) v1(3.67,74.39) v1(5.55,9.62) v1(6.02,74.39) v1(7.45,9.62) v1(7.97,74.39) v1(13.81,64.86) v1(13.93,67.27) v1(13.93,66.13) v1(30.06,22.06) v1(31.2,47.59) v1(31.2,46.06) v1(31.2,44.62) v1(31.46,22.06) v1(33.1,22.06) v1(48.73,50.64) v1(48.73,49.34) v1(48.73,47.97) v1(52.29,64.35) v1(52.29,63.09) v1(52.29,62.05) v1(55.11,19.13) v1(56.22,19.14) v1(82.26,6.82) v1(83.53,6.82) v1(84.81,6.82) v1(92.54,74.13) v1(94.42,74.13) v1(96.67,74.13)
VBAT: length 0.4
  Top Layer w1: v1(38.36,18.72) SW24V_1.4
  vias: v1(29.81,75.93) v1(30.82,75.91) v1(31.84,76.04) v1(38.32,17.74) v1(51.78,8.73) v1(52.54,8.34) v1(64.6,27.9) v1(65.88,28.41) v1(66.13,29.43)
VBUS:
  vias: v1(64.22,20.66) v1(64.6,21.55) v1(64.96,20.59)
A+: length 37.1
  Top Layer w0.254: 电机485输入1.4 3.64,34.9 3.47,34.72 3.47,20.92 4.85,19.53 电机485输入2.4 8.98,19.53 16.2,12.31 电机信号线.2
B-: length 37.3
  Top Layer w0.254: v1(3.39,35.9) 3.89,36.4 电机485输入1.3 ; v1(5.65,21.03) 9.63,21.03 v1(10.63,20.03)
  Bottom Layer w0.254: v1(5.65,21.03) 5.62,21.06 4.27,21.06 3.39,21.93 v1(3.39,35.9) ; 13.68,8.47 13.68,13.55 10.63,16.6 v1(10.63,20.03)
EN1: length 22.5
  Top Layer w1: VBAT降压5V_1.4 88.04,34.37 88.04,32.03 86.32,30.32 78.19,30.32 76.58,28.7 SW5V_1.2 76.58,21.5
EN2: length 19.1
  Top Layer w1: SW5V_2.5 SW5V_2.2 56.5,30.81 57.21,31.52 62.63,31.52 64.22,33.11 VBAT降压5V_2.4
$2N1435: length 4.7
  Top Layer w1: 23.58,19.34 SW24V_2.2
$2N5555: length 5.7
  Top Layer w1: SW24V_1.5 v1(40.86,22.59) v1(40.86,23.65) SW24V_1.2
  vias: v1(40.84,24.7)

## Copper pours and planes (outline as drawn; the poured copper is in the pictures)
+5V_2 on Bottom Layer: 56.1,67.02 60.92,67.02 60.92,61.43 56.1,61.43
+5V_2 on Bottom Layer: 57.49,80.23 72.61,80.23 72.61,55.46 57.49,55.46
+24V_1 on Bottom Layer: 38.32,74.48 53.43,74.48 53.43,68.03 38.32,68.03
+24V_2 on Top Layer: 10.82,71.39 23.71,71.39 23.71,44.67 10.82,44.67
+24V_2 on Bottom Layer: 7.37,25.72 42.25,25.72 42.25,3.01 7.37,3.01
+24V_2 on Bottom Layer: 3.9,39.59 13.3,39.59 13.3,23.33 3.9,23.33
+24V_2 on Bottom Layer: 3.39,50.64 19.27,50.64 19.27,36.54 3.39,36.54
GND on Top Layer: -15.79,93.05 121.5,93.05 121.5,-22.77 -15.79,-22.77
GND on Bottom Layer: -25.69,101.94 141.44,101.94 141.44,-33.82 -25.69,-33.82
VBAT on Top Layer: 56.35,36.16 70.19,36.16 70.19,7.84 56.35,7.84
VBAT on Top Layer: 5.42,79.85 33.12,79.85 33.12,64.1 5.42,64.1
VBAT on Top Layer: 50.38,11.9 56.86,11.9 56.86,5.49 50.38,5.49
VBAT on Top Layer: 17.49,26.25 39.59,26.25 39.59,13.17 17.49,13.17
VBAT on Bottom Layer: 63.46,48.6 88.99,48.6 88.99,32.35 63.46,32.35
VBAT on Bottom Layer: 29.43,67.78 58.45,67.78 58.45,50.21 29.43,50.21
VBAT on Bottom Layer: 47.71,9.23 57.87,9.23 57.87,5.63 47.71,5.63
VBAT on Bottom Layer: 27.27,80.35 37.17,80.35 37.17,66.13 27.27,66.13
VBAT on Bottom Layer: 83.78,64.73 89.62,64.73 89.62,46.7 83.78,46.7
VBAT on Bottom Layer: 36.66,19.96 49.77,19.96 49.77,6.19 36.66,6.19
VBAT on Bottom Layer: 55.97,54.83 66.38,54.83 66.38,37.68 55.97,37.68
VBAT on Bottom Layer: 82.26,35.58 93.05,35.58 93.05,23.97 82.26,23.97
VBAT on Bottom Layer: 82.51,39.31 93.05,39.31 93.05,34.63 82.51,34.63
VBUS on Top Layer: 62.83,23.46 83.53,23.46 83.53,12.28 62.83,12.28
VBUS on Bottom Layer: 53.18,25.87 66.85,25.87 66.85,18.25 53.18,18.25
VOP_5V on Bottom Layer: 76.42,68.96 89.73,68.96 89.73,63.46 76.42,63.46
VOP_5V on Bottom Layer: 87.43,71.21 96.1,71.21 96.1,66.97 87.43,66.97
VOP_5V on Bottom Layer: 77.43,79.59 89.37,79.59 89.37,67.78 77.43,67.78
$1N642 on Bottom Layer: 64.86,23.2 70.96,23.2 70.96,13.17 64.86,13.17
$1N648 on Top Layer: 50.76,14.95 56.48,14.95 56.48,11.77 50.76,11.77
$1N653 on Bottom Layer: 49.49,28.54 64.22,28.54 64.22,12.92 49.49,12.92
$2N1435 on Top Layer: 18,32.22 24.83,32.22 24.83,22.31 18,22.31
$2N5555 on Bottom Layer: 35.61,37.56 42.11,37.56 42.11,22.06 35.61,22.06

Small or netless copper shapes (teardrops, artwork), in the pictures only: 16 on Top Layer, 3 on Bottom Layer

## Text on the board
Top Silkscreen Layer: 2026.8.11
